# Altium project TimeDrive.PrjPcb (part 3 of 3)
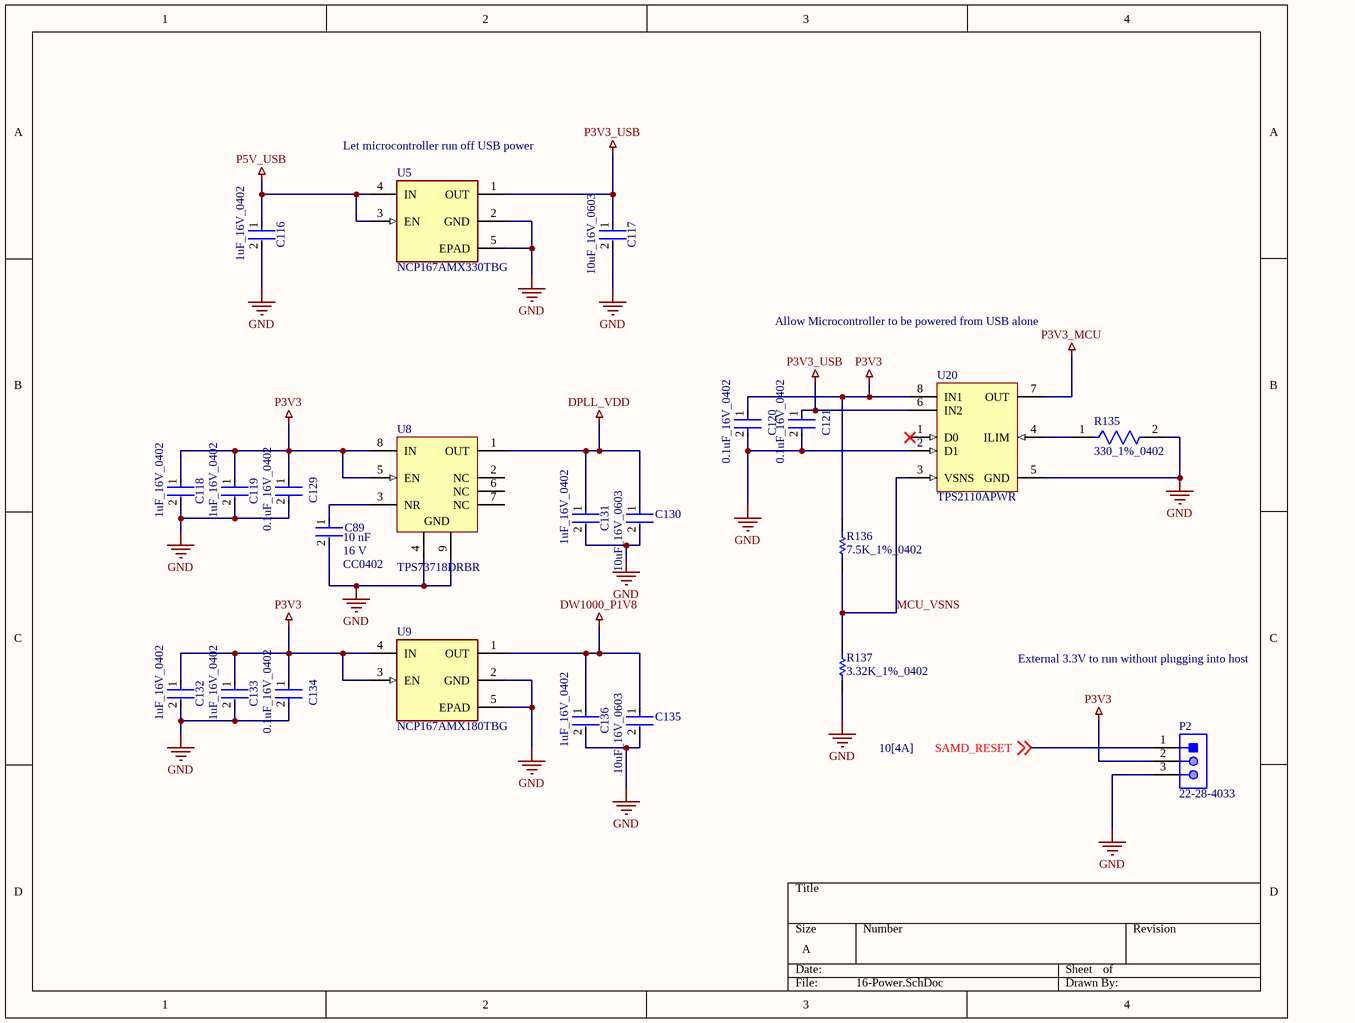
[diagram p12: 16-Power.SchDoc]

## Nets that join several sheets
DPLL_VDD: 04-AD9546-Main (25 pins), 16-Power (C130.1 C131.1 U8.1)
GND: 04-AD9546-Main (15 pins), 05-AD9546_StrapsXtal (13 pins), 06-AD9546_TimestampInputs (28 pins), 07-AD9546_Outputs (6 pins), 08-AD9513-1 (22 pins), 09-AD9513-2 (33 pins), 10-Microcontroller-1 (20 pins), 11-UWB-Main (U12.32 U12.43 U12.46 U12.49), 13-UWB-Antenna (U13.2 U13.5), 14-I225-Main (10 pins), 15-I225-MISC (29 pins), 16-Power (26 pins)
P0V95_I225: 14-I225-Main (7 pins), 15-I225-MISC (11 pins)
P3V3: 04-AD9546-Main (C4.1 C5.2 U1.3 U1.34), 05-AD9546_StrapsXtal (6 pins), 06-AD9546_TimestampInputs (10 pins), 08-AD9513-1 (19 pins), 09-AD9513-2 (24 pins), 10-Microcontroller-1 (R83.2 R86.2), 14-I225-Main (14 pins), 15-I225-MISC (25 pins), 16-Power (14 pins)
P3V3_MCU: 10-Microcontroller-1 (17 pins), 16-Power (U20.7)
P5V_USB: 10-Microcontroller-1 (C53.1 D8.5 J8.1), 16-Power (C116.1 U5.3 U5.4)
1PPS_0_P: 08-AD9513-1 (R41.2), 11-UWB-Main (U12.29)
1PPS_2_P: 06-AD9546_TimestampInputs (R28.1), 08-AD9513-1 (U6.19)
1PPS_5_P: 09-AD9513-2 (R53.2), 10-Microcontroller-1 (U10.19)
DPLL_9513_1PPS_0_N: 07-AD9546_Outputs (R37.2), 08-AD9513-1 (U6.3)
DPLL_9513_1PPS_0_P: 07-AD9546_Outputs (R34.2), 08-AD9513-1 (U6.2)
DPLL_9513_1PPS_1_N: 07-AD9546_Outputs (R138.2), 09-AD9513-2 (U7.3)
DPLL_9513_1PPS_1_P: 07-AD9546_Outputs (R38.2), 09-AD9513-2 (U7.2)
DPLL_CSB: 04-AD9546-Main (U1.5), 10-Microcontroller-1 (R64.1)
DPLL_LDO0: 04-AD9546-Main (U1.7), 05-AD9546_StrapsXtal (C15.2 C17.1)
DPLL_LDO1: 04-AD9546-Main (U1.30), 05-AD9546_StrapsXtal (C16.2 C18.1)
DPLL_LF0: 04-AD9546-Main (U1.8), 05-AD9546_StrapsXtal (C15.1)
DPLL_LF1: 04-AD9546-Main (U1.29), 05-AD9546_StrapsXtal (C16.1)
DPLL_M0: 04-AD9546-Main (U1.32), 06-AD9546_TimestampInputs (R28.2 R29.2)
DPLL_M1: 04-AD9546-Main (U1.33), 06-AD9546_TimestampInputs (R20.1)
DPLL_M2: 04-AD9546-Main (U1.35), 06-AD9546_TimestampInputs (R16.1 R19.2)
DPLL_M3: 04-AD9546-Main (U1.36), 05-AD9546_StrapsXtal (R7.1)
DPLL_M4: 04-AD9546-Main (U1.37), 05-AD9546_StrapsXtal (R8.1)
DPLL_M5: 04-AD9546-Main (U1.1), 10-Microcontroller-1 (R66.1)
DPLL_OUT_0A_N: 04-AD9546-Main (U1.12), 07-AD9546_Outputs (C26.2 R33.1)
DPLL_OUT_0A_P: 04-AD9546-Main (U1.11), 07-AD9546_Outputs (C25.2 R32.2)
DPLL_OUT_0B_N: 04-AD9546-Main (U1.15), 07-AD9546_Outputs (R36.1 R37.1)
DPLL_OUT_0B_P: 04-AD9546-Main (U1.14), 07-AD9546_Outputs (R34.1 R35.2)
DPLL_OUT_1A_N: 04-AD9546-Main (U1.26), 07-AD9546_Outputs (R40.1 R138.1)
DPLL_OUT_1A_P: 04-AD9546-Main (U1.25), 07-AD9546_Outputs (R38.1 R39.2)
DPLL_REFA: 04-AD9546-Main (U1.47), 06-AD9546_TimestampInputs (R30.2 R31.2)
DPLL_REFAA: 04-AD9546-Main (U1.46), 05-AD9546_StrapsXtal (R139.1 R140.2)
DPLL_REFB: 04-AD9546-Main (U1.38), 06-AD9546_TimestampInputs (R23.1 R25.2)
DPLL_REFBB: 04-AD9546-Main (U1.39), 06-AD9546_TimestampInputs (R27.1)
DPLL_RESETB: 04-AD9546-Main (U1.48), 05-AD9546_StrapsXtal (R12.1), 10-Microcontroller-1 (R65.1)
DPLL_SCLK: 04-AD9546-Main (U1.2), 10-Microcontroller-1 (R59.1)
DPLL_SDIO: 04-AD9546-Main (U1.4), 10-Microcontroller-1 (R63.1)
DPLL_XOA: 04-AD9546-Main (U1.42), 05-AD9546_StrapsXtal (R14.1)
DPLL_XOB: 04-AD9546-Main (U1.43), 05-AD9546_StrapsXtal (R15.2)
DW1000_38P4MHz_CLK_N: 07-AD9546_Outputs (C26.1), 11-UWB-Main (U12.4)
DW1000_38P4MHz_CLK_P: 07-AD9546_Outputs (C25.1), 11-UWB-Main (U12.3)
DW1000_FORCEON: 10-Microcontroller-1 (R71.1), 11-UWB-Main (U12.22)
DW1000_IRQ: 10-Microcontroller-1 (R69.1), 11-UWB-Main (U12.45)
DW1000_RF_N: 11-UWB-Main (U12.17), 13-UWB-Antenna (C82.1)
DW1000_RF_P: 11-UWB-Main (U12.16), 13-UWB-Antenna (C83.1)
DW1000_RSTn: 10-Microcontroller-1 (R74.1), 11-UWB-Main (U12.27)
DW1000_SPICLK: 10-Microcontroller-1 (R76.1), 11-UWB-Main (U12.41)
DW1000_SPICSn: 10-Microcontroller-1 (R77.1), 11-UWB-Main (U12.24)
DW1000_SPIMISO: 10-Microcontroller-1 (R78.1), 11-UWB-Main (U12.40)
DW1000_SPIMOSI: 10-Microcontroller-1 (R75.1), 11-UWB-Main (U12.39)
DW1000_WAKEUP: 10-Microcontroller-1 (R73.1), 11-UWB-Main (U12.23)
I225_CLKREQ_N: 14-I225-Main (U14.3), 15-I225-MISC (R123.1)
I225_DISABLE_N: 14-I225-Main (U14.2), 15-I225-MISC (R127.1 R132.2)
I225_JTAG_CLK: 14-I225-Main (U14.29), 15-I225-MISC (R134.2)
I225_JTAG_RSTN: 14-I225-Main (U14.16), 15-I225-MISC (R133.2)
I225_LAN_PWR_GOOD: 14-I225-Main (U14.1), 15-I225-MISC (R126.1)
I225_RST_N: 14-I225-Main (U14.13), 15-I225-MISC (R124.1)
I225_SCK: 10-Microcontroller-1 (R80.1), 14-I225-Main (R89.1)
I225_SDA: 10-Microcontroller-1 (R79.1), 14-I225-Main (R95.1)
I225_SDP0: 08-AD9513-1 (R43.2), 14-I225-Main (R108.1)
I225_SDP1: 14-I225-Main (R117.1), 15-I225-MISC (R88.1 R102.1 R128.1 U16.2)
I225_SDP2: 06-AD9546_TimestampInputs (R30.1), 14-I225-Main (R115.1)
I225_SDP3: 14-I225-Main (R116.1), 15-I225-MISC (R42.1 R96.1 R101.1 U16.1)
I225_ULP_WAKE_N: 14-I225-Main (U14.4), 15-I225-MISC (R122.1)
I225_WAKE_N: 14-I225-Main (U14.12), 15-I225-MISC (R125.1)
SAMD_RESET: 10-Microcontroller-1 (R44.2), 16-Power (P2.1)
SAMD_SCK: 10-Microcontroller-1 (U10.8), 15-I225-MISC (R54.1 R88.2 R96.2 U16.5)
SAMD_SDA: 10-Microcontroller-1 (U10.7), 15-I225-MISC (R87.1 U16.4)
SAMD_SWCLK: 10-Microcontroller-1 (R45.1 R50.1), 15-I225-MISC (R102.2 U16.8)
SAMD_SWDIO: 10-Microcontroller-1 (R46.1 R52.1), 15-I225-MISC (R101.2 U16.7)